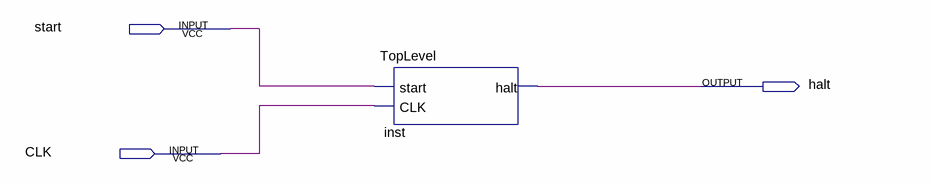
[diagram p0: schematic sheet]
// Quartus schematic TopLevel.bdf as structural Verilog: 1 symbols, 3 pins
module TopLevel (
  input  start,
  input  CLK,
  output halt
);

  TopLevel inst (.start(start), .CLK(CLK), .halt(halt));
endmodule
